# EAGLE design Humus_ethernet_dip_v2 (EAGLE 6.5.0)
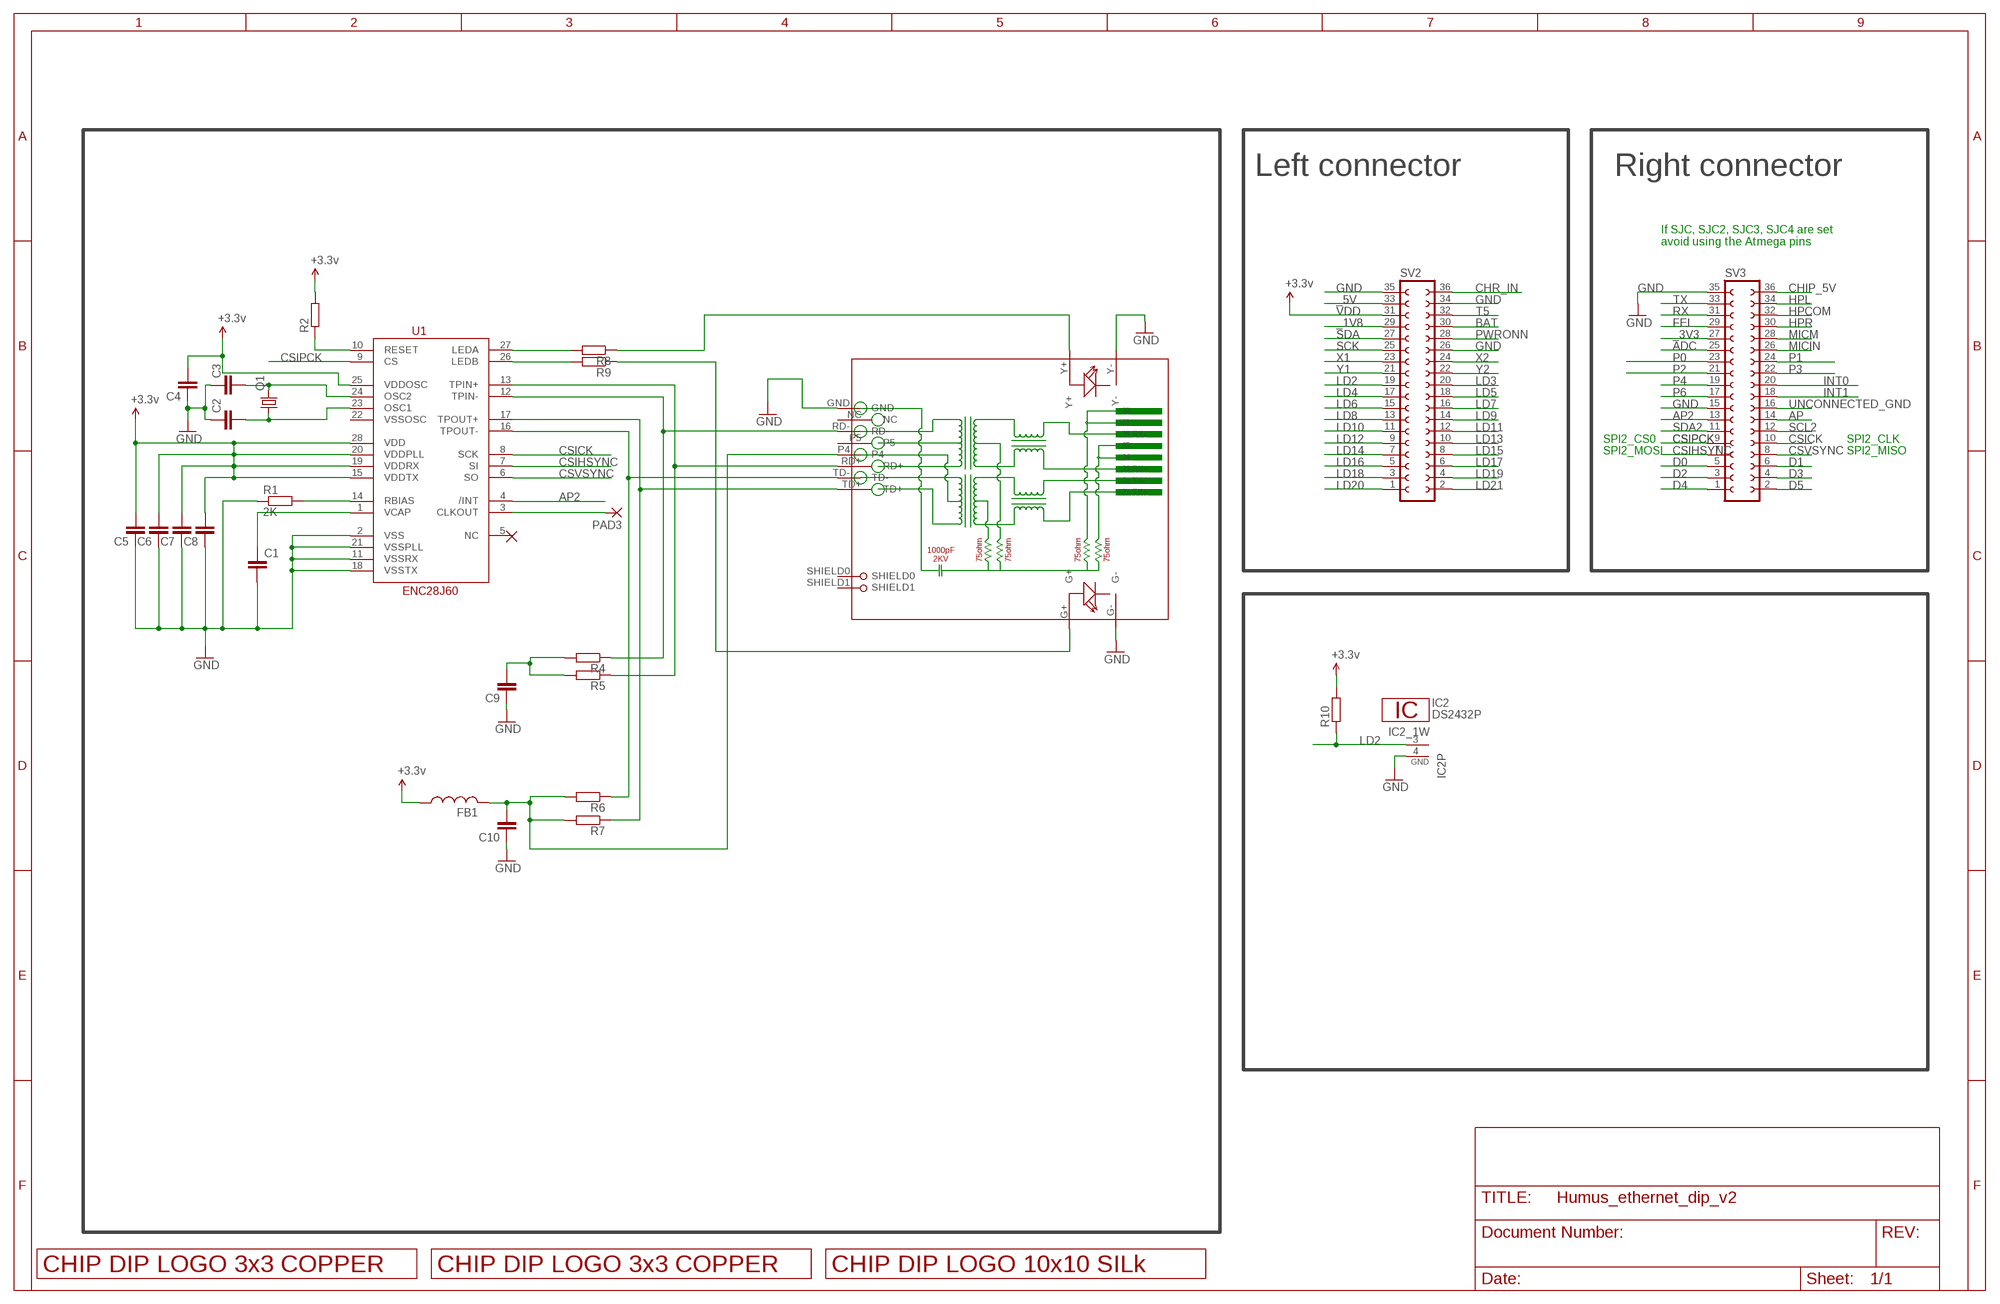
[diagram p0: schematic, sheet 1]

## Parts
C1  C-EUC0805  [C0805]
C2  C-EUC0805  [C0805]
C3  C-EUC0805  [C0805]
C4  C-EUC0805  [C0805]
C5  C-EUC0805  [C0805]
C6  C-EUC0805  [C0805]
C7  C-EUC0805  [C0805]
C8  C-EUC0805  [C0805]
C9  C-EUC0805  [C0805]
C10  C-EUC0805  [C0805]
FB1  FERRITE-BEADB  [0805]
IC2  DS2432P  [TSOC6]
PAD3  WIREPADSMD1,27-254  [SMD1,27-2,54]
Q1  CRYSTALSM49  [SM49]
R1  2K  R-EU_R0805  [R0805]
R2  R-EU_R0805  [R0805]
R4  R-EU_R0805  [R0805]
R5  R-EU_R0805  [R0805]
R6  R-EU_R0805  [R0805]
R7  R-EU_R0805  [R0805]
R8  R-EU_R0805  [R0805]
R9  R-EU_R0805  [R0805]
R10  R-EU_R0805  [R0805]
RJ1  HR911105A  [HR911105A]
SV2  FE18-2  [FE18-2]
SV3  FE18-2  [FE18-2]
U1  ENC28J60  [SSOP28DB]
U$2  LOGO_3X3_COPPER  [LOGO_3X3_COPPER]
U$4  LOGO_3X3_COPPER  [LOGO_3X3_COPPER]
U$5  LOGO_10X10_SILK  [LOGO_10X10_SILK]

## Nets
_1V8: SV2.29
_3V3: SV3.27
_5V: SV2.33
ADC: SV3.25
AP: SV3.14
AP2: SV3.13 U1.4(/INT)
BAT: SV2.30
CHIP_5V: SV3.36
CHR_IN: SV2.36
CSICK: SV3.10 U1.8(SCK)
CSIHSYNC: SV3.7 U1.7(SI)
CSIPCK: SV3.9 U1.9(CS)
CSVSYNC: SV3.8 U1.6(SO)
CT: C10.2 FB1.2 R6.2 R7.2 RJ1.P4
D0: SV3.5
D1: SV3.6
D2: SV3.3
D3: SV3.4
D4: SV3.1
D5: SV3.2
FEL: SV3.29
GND: C1.2 C2.1 C3.1 C4.1 C5.1 C6.1 C7.1 C8.1 C9.1 C10.1 IC2.4(GND) R1.1 RJ1.G- RJ1.GND RJ1.Y- SV2.26 SV2.34 SV2.35 SV3.15 SV3.35 U1.2(VSS) U1.11(VSSRX) U1.18(VSSTX) U1.21(VSSPLL)
HPCOM: SV3.32
HPL: SV3.34
HPR: SV3.30
INT0: SV3.20
INT1: SV3.18
LD2: IC2.3(1W) R10.1 SV2.19
LD3: SV2.20
LD4: SV2.17
LD5: SV2.18
LD6: SV2.15
LD7: SV2.16
LD8: SV2.13
LD9: SV2.14
LD10: SV2.11
LD11: SV2.12
LD12: SV2.9
LD13: SV2.10
LD14: SV2.7
LD15: SV2.8
LD16: SV2.5
LD17: SV2.6
LD18: SV2.3
LD19: SV2.4
LD20: SV2.1
LD21: SV2.2
MICIN: SV3.26
MICM: SV3.28
N$1: C1.1 U1.1(VCAP)
N$2: R2.1 U1.10(RESET)
N$3: R1.2 U1.14(RBIAS)
N$6: C3.2 Q1.2 U1.24(OSC2)
N$7: C2.2 Q1.1 U1.23(OSC1)
N$10: R8.1 RJ1.Y+
N$11: R9.1 RJ1.G+
N$13: PAD3.1(P) U1.3(CLKOUT)
N$14: C9.2 R4.2 R5.2
N$15: R8.2 U1.27(LEDA)
N$16: R9.2 U1.26(LEDB)
P0: SV3.23
P1: SV3.24
P2: SV3.21
P3: SV3.22
P4: SV3.19
P6: SV3.17
PWRONN: SV2.28
RD+: R5.1 RJ1.RD+ U1.13(TPIN+)
RD-: R4.1 RJ1.RD- U1.12(TPIN-)
RX: SV3.31
SCK: SV2.25
SCL2: SV3.12
SDA: SV2.27
SDA2: SV3.11
T5: SV2.32
TD+: R7.1 RJ1.TD+ U1.17(TPOUT+)
TD-: R6.1 RJ1.TD- U1.16(TPOUT-)
TX: SV3.33
UNCONNECTED_GND: SV3.16
VDD: C4.2 C5.2 C6.2 C7.2 C8.2 FB1.1 R2.2 R10.2 SV2.31 U1.15(VDDTX) U1.19(VDDRX) U1.20(VDDPLL) U1.25(VDDOSC) U1.28(VDD) ; supply symbol labelled +3.3v
X1: SV2.23
X2: SV2.24
Y1: SV2.21
Y2: SV2.22
Unconnected: RJ1.NC RJ1.P5 RJ1.SHIELD0 RJ1.SHIELD1 U1.5(NC) U1.22(VSSOSC)

## Notes on the sheet
- Left connector | Right connector
- If SJC, SJC2, SJC3, SJC4 are set 
  avoid using the Atmega pins
- SPI2_CS0 | SPI2_CLK
- SPI2_MOSI | SPI2_MISO

## Library data of the parts
C1-C10 = rcl:C-EU: CAPACITOR, European symbol
FB1 = m-pad-2.1:FERRITE-BEAD: Ferrite beads in various packages
IC2 = 1wire:DS2432: 1024-Bit Protected EEPROM with SHA-1 Engine This chip is a cryptographic device, providing 1024 Bits of EEPROM memory which may be written only after supplying the correct 64 bit secret. the secret cannot be read back from the device. The other features of this chip are like the DS2431. Please note the SHA-1 hash algorithm is considered weak if the data is not properly "padded". If you don't understand anything of this, don't use this chip. Author: Jan Kandziora <jjj@gmx.de>
PAD3 = wirepad:WIREPAD: Wire PAD connect wire on PCB
Q1 = adafruit:CRYSTAL: CRYSTAL; OC_FARNELL: unknown; OC_NEWARK: unknown
R1 R2 R4-R10 = rcl:R-EU_: RESISTOR, European symbol
RJ1 = CONNECTER:HR911105A
SV2 SV3 = con-lsta:FE18-2: FEMALE HEADER; OC_FARNELL: unknown; OC_NEWARK: unknown
U1 = SparkFun-DigitalIC:ENC28J60: Microchip SPI 10Base ethernet IC
U$2 U$4 = logo:LOGO_3X3_COPPER
U$5 = logo:LOGO_10X10_SILK

## Board
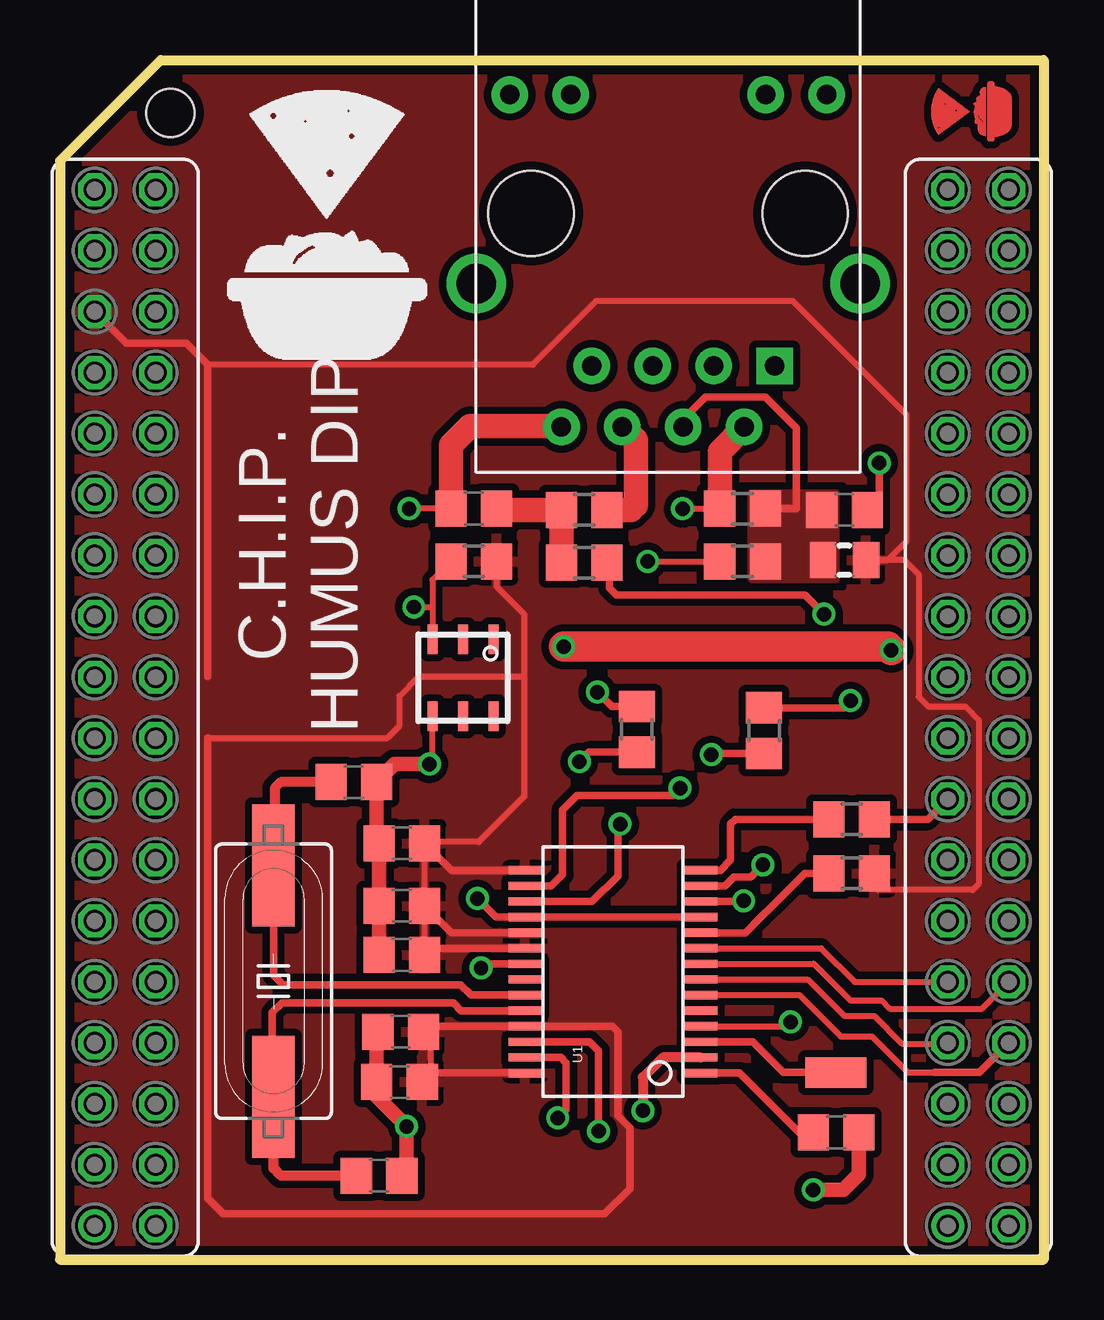
[diagram p1: board, top side]
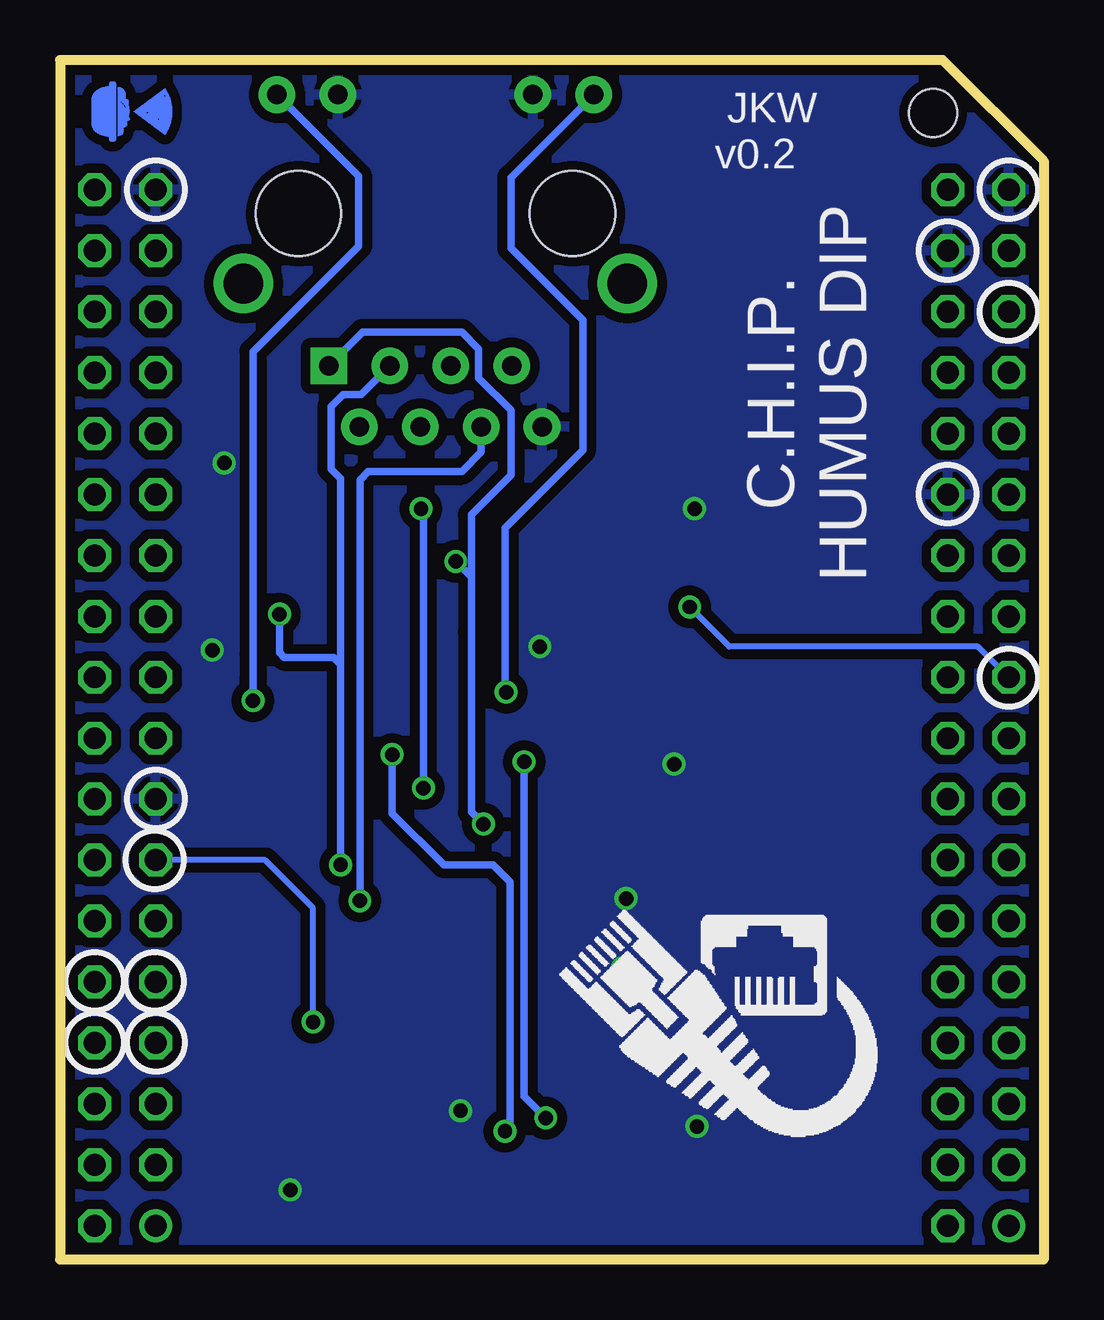
[diagram p2: board, bottom side, seen from below]

Size 41 x 50 mm. Coordinates in mm from the lower left corner, seen from the top.
Outline: 0,45.8 4.2,50 41,50 41,0 0,0 0,45.8
Copper layers (1*16): Top 0.0356mm / dielectric 1.5011mm / Bottom 0.0356mm
Design rules "LaenPCBOrder": minimum track width 6mil, minimum drill 13mil, track to track 6mil, track to pad 6mil, pad to pad 6mil, via to via 6mil, smd to smd 6mil, copper to edge 15mil, drill to drill 6mil, minimum pad ring 7mil, minimum via ring 7mil, stop-mask expansion 3mil, vias tented up to drill 0mil, thermal gap 10mil
Holes 2 mm at 4.6,47.8

### Footprints (pad centres in the part's own frame; a part is rotated, then mirrored left to right if it is on the bottom)
C0805 = smd 1.3 x 1.5: 1 -0.95,0; 2 0.95,0
0805 = smd 1.1 x 1.5: 1 -0.9,0; 2 0.9,0
TSOC6 = smd 0.406 x 1.219: 1 -1.27,-1.6; 2 0,-1.6; 3 1.27,-1.6; 4 1.27,1.6; 5 0,1.6; 6 -1.27,1.6
SMD1,27-2,54 = smd 1.27 x 2.54: 1 0,0
SM49 = smd 5.08 x 1.778: 1 -4.826,0; 2 4.826,0
R0805 = smd 1.3 x 1.5: 1 -0.95,0; 2 0.95,0
HR911105A = drill 0.813 pad 1.524: G+ 4.953,-6.604; G- 4.953,-4.064; GND -8.89,4.445; NC -6.35,3.175; P4 -8.89,-0.635; P5 -6.35,0.635; RD+ -6.35,-1.905; RD- -8.89,1.905; TD- -8.89,-3.175; Y+ 4.953,6.604; Y- 4.953,4.064 | drill 1.651 pad 2.159: SHIELD0 -2.921,8.001; SHIELD1 -2.921,-8.001 | drill 0.813 pad 1.524 square: TD+ -6.35,-4.445 | hole 3.556: 0,-5.715; 0,5.715
FE18-2 = drill 0.914: 1 -21.59,1.27 | drill 0.914 octagon: 2 -21.59,-1.27; 3 -19.05,1.27; 4 -19.05,-1.27; 5 -16.51,1.27; 6 -16.51,-1.27; 7 -13.97,1.27; 8 -13.97,-1.27; 9 -11.43,1.27; 10 -11.43,-1.27; 11 -8.89,1.27; 12 -8.89,-1.27; 13 -6.35,1.27; 14 -6.35,-1.27; 15 -3.81,1.27; 16 -3.81,-1.27; 17 -1.27,1.27; 18 -1.27,-1.27; 19 1.27,1.27; 20 1.27,-1.27; 21 3.81,1.27; 22 3.81,-1.27; 23 6.35,1.27; 24 6.35,-1.27; 25 8.89,1.27; 26 8.89,-1.27; 27 11.43,1.27; 28 11.43,-1.27; 29 13.97,1.27; 30 13.97,-1.27; 31 16.51,1.27; 32 16.51,-1.27; 33 19.05,1.27; 34 19.05,-1.27; 35 21.59,1.27; 36 21.59,-1.27
SSOP28DB = smd 0.348 x 1.397: 1 -4.225,-3.656; 2 -3.575,-3.656; 3 -2.925,-3.656; 4 -2.275,-3.656; 5 -1.625,-3.656; 6 -0.975,-3.656; 7 -0.325,-3.656; 8 0.325,-3.656; 9 0.975,-3.656; 10 1.625,-3.656; 11 2.275,-3.656; 12 2.925,-3.656; 13 3.575,-3.656; 14 4.225,-3.656; 15 4.225,3.656; 16 3.575,3.656; 17 2.925,3.656; 18 2.275,3.656; 19 1.625,3.656; 20 0.975,3.656; 21 0.325,3.656; 22 -0.325,3.656; 23 -0.975,3.656; 24 -1.625,3.656; 25 -2.275,3.656; 26 -2.925,3.656; 27 -3.575,3.656; 28 -4.225,3.656

### Placement (x,y rotation side)
C1  32.35,5.3 0 top
C2  12.25,19.9 180 top
C3  13.3,3.5 180 top
C4  14.2,9.5 0 top
C5  14.15,7.4 0 top
C6  14.25,12.7 0 top
C7  14.25,14.75 0 top
C8  14.25,17.35 0 top
C9  17.25,31.3 0 top
C10  32.7,31.25 180 top
FB1  32.7,29.15 180 top
IC2  16.8,24.25 180 top
PAD3  32.35,7.8 270 top
Q1  8.9,11.6 270 top
R1  33,18.35 180 top
R2  33,16.1 0 top
R4  21.85,31.25 180 top
R5  21.85,29.05 180 top
R6  28.45,31.3 0 top
R7  28.45,29.1 0 top
R8  24.05,22.1 270 top
R9  29.35,22.05 270 top
R10  17.25,29.1 0 top
RJ1  25.35,43.6 90 top
SV2  2.72,23 90 top
SV3  38.28,23 90 top
U1  23.05,12 90 top
U$2  38,47.85 90 top
U$4  38,47.85 270 bottom
U$5  6.95,37.5 0 top

### Tracks (layer width: path | path; a pad name or v marks a point on that pad's centre or on a via)
AP2  (via drill 0.6)
  Top 0.254: U1.4 30.27,9.72 v30.45,9.9
  Bottom 0.254: v30.45,9.9 30.45,14.65 32.45,16.65 SV3.13
CSICK
  Top 0.254: U1.8 31.43,12.32 32.95,10.8 34.25,10.8 34.6,10.45 38.43,10.45 SV3.10
CSIHSYNC
  Top 0.254: U1.7 31.18,11.68 32.7,10.15 33.95,10.15 35.1,9 36.98,9 SV3.7
CSIPCK
  Top 0.254: U1.9 31.73,12.97 33.13,11.57 SV3.9
CSVSYNC
  Top 0.254: U1.6 30.82,11.03 32.55,9.3 33.85,9.3 35.35,7.8 36.45,7.8
  Top 0.305: 36.45,7.8 38.32,7.8 SV3.8
CT
  Top 0.254: FB1.2 31.75,29.2 | 29.75,31.65 R6.2
  Top 0.305: 31.75,29.1 FB1.2 | 29.45,31.25 R6.2 30.7,31.3 30.7,34.65 29.4,35.95 26.9,35.95 25.98,35.03 RJ1.P4
  pour Top (no thermals): 28.85,28.35 32.35,28.35 32.35,31.95 28.8,31.95 28.8,28.4
GND  (via drill 0.6)
  Top 0.254: C9.1 v14.55,31.3 | C10.1 34.15,31.75 | v15.4,20.65 15.53,20.78 IC2.4
  Top 0.305: 34.15,31.75 v34.15,33.2 | SV3.15 36.17,18.35 R1.1 | U1.21 17.73,12.32 v17.55,12.15 | 20.86,34.75 RJ1.GND | U1.11 U1.18 18.18,14.28 v17.4,15.05
  Top 0.406: U1.2 25.12,8.43 24.3,7.6 v24.3,6.2
  Top 0.61: C6.1 C7.1 C8.1 13.2,17.45 C2.1 13.95,20.65 v15.4,20.65 | C3.1 14.45,3.7 v14.45,5.55 13.2,6.8 C5.1 13.2,9.45 C4.1 | C1.2 33.3,3.55 32.65,2.9 v31.4,2.9
  Top 1.016: C9.1 16.3,33.95 17.1,34.75 20.86,34.75
  Top 1.27: v21,25.55 34.5,25.55 v34.65,25.4
  pour Bottom (isolate 0.406): 4.2,50 41.05,50 41.05,0.25 0.02,0.25 0,45.8
LD2  (via drill 0.6)
  Top 0.254: 15.53,27.15 15.53,28.33 R10.1 16.25,29.15 | 15.53,27.15 IC2.3 | v14.75,27.2 15.48,27.2 15.53,27.15
  Bottom 0.254: SV2.19 2.73,25.55 13.1,25.55 v14.75,27.2
N$1
  Top 0.254: 30.8,5.3 C1.1
  Top 0.305: U1.1 28.32,7.78 30.8,5.3
N$2
  Top 0.305: U1.10 28.57,13.62 29.23,14.28 29.65,14.7 31.05,16.1 R2.1
N$3
  Top 0.305: U1.14 27.52,16.23 27.95,16.65 27.95,18.15 28.15,18.35 R1.2
N$6
  Top 0.254: 8.85,6.82 Q1.2
  Top 0.305: U1.24 16.73,10.38 16.4,10.7 9.25,10.7 8.85,10.3 8.85,6.82
  Top 0.406: C3.2 9.2,3.5 8.9,3.8 Q1.2
N$7
  Top 0.254: 8.95,16.48 Q1.1
  Top 0.305: U1.23 17.12,11.03 16.7,11.45 9.3,11.45 8.9,11.85 Q1.1
  Top 0.406: C2.2 9.2,19.9 8.95,19.65 8.95,16.48
N$10  (via drill 0.6)
  Top 0.305: R8.1 23,23.05 v22.4,23.65
  Bottom 0.305: RJ1.Y+ 22.2,45.1 22.2,42.15 19.2,39.15 19.2,33.75 22.45,30.5 22.45,23.7 v22.4,23.65
N$11  (via drill 0.6)
  Top 0.305: R9.1 32.65,23 v32.95,23.3
  Bottom 0.305: RJ1.G+ 28.55,45.15 28.55,42.25 32.95,37.85 32.95,25.25 32.95,24.25 v32.95,23.3
N$13
  Top 0.305: U1.3 28.88,9.07 30.15,7.8 PAD3.1
N$14
  Top 0.305: 18.25,31.25 C9.2
  Top 1.016: R5.2 R4.2 18.25,31.25
N$15  (via drill 0.6)
  Top 0.305: U1.27 20.88,8.43 21.1,8.2 21.1,6.25 v20.75,5.9 | R8.2 22.05,21.15 v21.65,20.75
  Bottom 0.305: v20.75,5.9 21.3,6.45 21.65,6.8 v21.65,20.75
N$16  (via drill 0.6)
  Top 0.305: U1.26 22.07,9.07 22.45,8.7 v22.45,5.35 | v27.15,21.05 27.2,21.1 R9.2
  Bottom 0.254: 22.25,5.55 v22.45,5.35
  Bottom 0.305: 22.25,5.55 22.25,15.75 22.95,16.45 25,16.45 27.15,18.6 v27.15,21.05
RD+  (via drill 0.6)
  Top 0.254: 22.9,28.95 R5.1
  Top 0.305: U1.13 27.73,15.57 28.1,15.95 28.8,15.95 v29.3,16.45 | v31.85,26.9 31.05,27.7 23.2,27.7 22.9,28 22.9,28.95
  Bottom 0.305: v29.3,16.45 29.3,24.8 | RJ1.RD+ 28.45,36.05 29.2,36.05 29.7,35.55 29.7,32.95 29.3,32.55 29.3,24.8 | v31.85,26.9 31.85,25.3 31.65,25.1 29.6,25.1 29.3,24.8
RD-  (via drill 0.6)
  Top 0.254: 28.48,14.93 v28.5,14.95
  Top 0.305: U1.12 28.48,14.93 | 23.8,31.25 24,31.45
  Top 1.016: R4.1 23.8,31.25 | 24,31.45 24,34.16 RJ1.RD-
  Bottom 0.305: v28.5,14.95 28.5,32.5 28.15,32.85 24.25,32.85 23.45,33.66 RJ1.RD-
TD+  (via drill 0.6)
  Top 0.254: v24.5,29.1 R7.1 | 23.25,18.05 v23.35,18.15
  Top 0.305: U1.17 22.18,14.93 23.25,16 23.25,18.05
  Bottom 0.305: 23.85,28.45 v24.5,29.1 | 23.85,28.45 23.85,26.15 23.85,18.65 v23.35,18.15 | RJ1.TD+ 28.39,38.65 24.25,38.65 23.55,37.95 23.55,36.75 22.2,35.4 22.2,32.7 23.85,31.05 23.85,28.45
TD-  (via drill 0.6)
  Top 0.254: v25.95,31.3 R6.1 | 25.55,19.35 v25.85,19.65
  Top 0.305: U1.16 20.48,15.57 20.95,16.05 20.95,18.75 21.55,19.35 25.55,19.35
  Top 1.016: R6.1 27.5,33.69 RJ1.TD-
  Bottom 0.254: 25.85,31.2 v25.95,31.3
  Bottom 0.305: v25.85,19.65 25.85,31.2
VDD
  Top 0.254: C5.2 15.47,7.78 15.47,9.18 C4.2 15.38,9.72 | C6.2 15.4,12.9 | 6.15,21.75 13.65,21.75 14.15,22.25 14.15,23.5 14.95,24.3 19.3,24.3 19.35,24.25 | 19.35,24.25 19.35,19.3 17.45,17.4 15.25,17.4 C8.2 C7.2 15.2,13.1 15.4,12.9 | R10.2 18.2,28.05 19.35,26.9 19.35,24.25 | 33.95,15.55 34.1,15.4 38.05,15.4 38.3,15.65 38.3,22.5 37.75,23.05 36.2,23.05 35.8,23.45 35.8,28.55 35.2,29.15 FB1.1 34.5,29.15 35.3,29.95 35.3,35.2 30.55,39.95 22.35,39.95 19.7,37.3 6.15,37.3 | 15.47,12.97 15.4,12.9
  Top 0.305: U1.28 15.47,7.78 | 15.38,9.72 U1.25 23.02,9.72 23.25,9.5 23.25,6 23.75,5.5 23.75,2.95 22.7,1.9 6.8,1.9 6.15,2.55 6.15,21.75 | 15.47,12.97 U1.20 | U1.19 16.32,13.62 C7.2 | U1.15 16.32,16.23 C8.2 | 6.15,24.3 6.15,37.3 5.25,38.2 2.76,38.2 SV2.31
  Top 0.406: 33.95,15.55 R2.2
  pour Top (isolate 0.305, rank 2): -0.07,0.25 40.88,0.25 41.01,10.57 41.01,50.01 5,50 4.2,50.01 0,45.8 0,10.47

### Text on the board
bPlace: JKW / v0.2
tNames: C.H.I.P. / HUMUS DIP
bNames: C.H.I.P. / HUMUS DIP